# Altium schematic sheet DAC.SchDoc
size A4
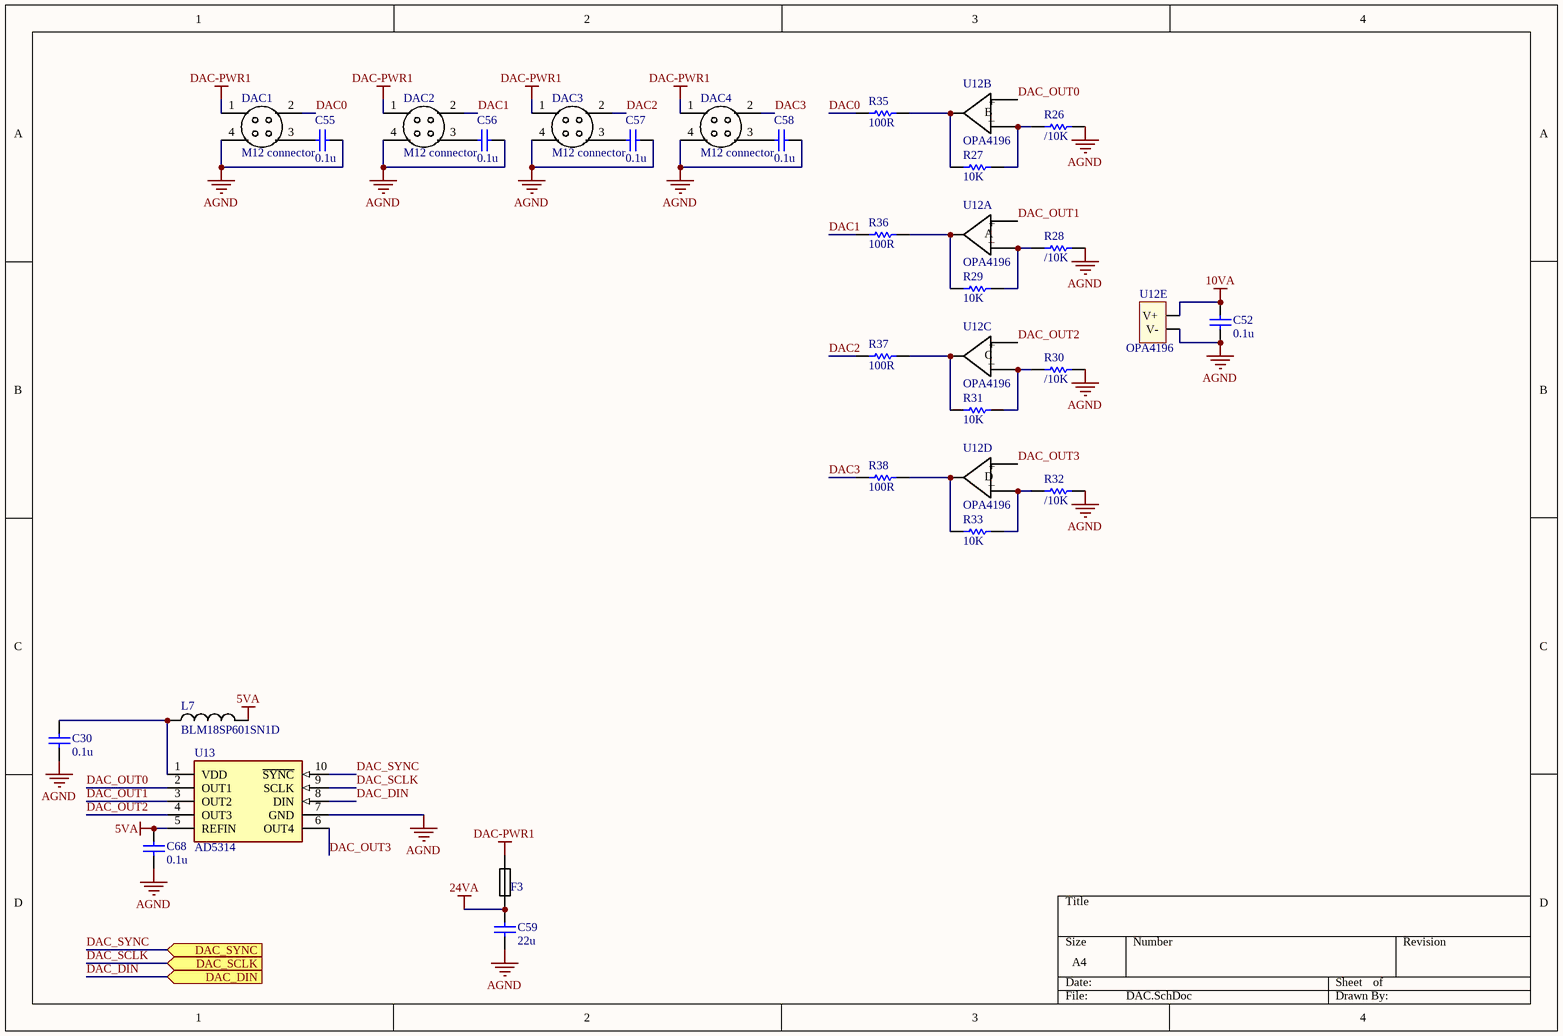
[diagram p0: DAC.SchDoc]

## Parts
C30  value 0.1u  [CAPC1608X90N]  (hidden comment: Cap)
C52  value 0.1u  [CAPC1608X90N]  (hidden comment: Cap)
C55  value 0.1u  [CAPC1608X90N]  (hidden comment: Cap)
C56  value 0.1u  [CAPC1608X90N]  (hidden comment: Cap)
C57  value 0.1u  [CAPC1608X90N]  (hidden comment: Cap)
C58  value 0.1u  [CAPC1608X90N]  (hidden comment: Cap)
C59  value 22u  [CAPC2012X135N]  (hidden comment: Cap)
C68  value 0.1u  [CAPC1608X90N]  (hidden comment: Cap)
DAC1  M12 connector  [GX12_PCB_Mount]
DAC2  M12 connector  [GX12_PCB_Mount]
DAC3  M12 connector  [GX12_PCB_Mount]
DAC4  M12 connector  [GX12_PCB_Mount]
F3  MFU0805FF00500P100  [RESC2012X70N]  (value not drawn)
L7  BLM18SP601SN1D  [INDC1608N]
R26  value /10K  [RESC1608X55N]  (hidden comment: Res1)
R27  value 10K  [RESC1608X55N]  (hidden comment: Res1)
R28  value /10K  [RESC1608X55N]  (hidden comment: Res1)
R29  value 10K  [RESC1608X55N]  (hidden comment: Res1)
R30  value /10K  [RESC1608X55N]  (hidden comment: Res1)
R31  value 10K  [RESC1608X55N]  (hidden comment: Res1)
R32  value /10K  [RESC1608X55N]  (hidden comment: Res1)
R33  value 10K  [RESC1608X55N]  (hidden comment: Res1)
R35  value 100R  [RESC1608X55N]  (hidden comment: Res1)
R36  value 100R  [RESC1608X55N]  (hidden comment: Res1)
R37  value 100R  [RESC1608X55N]  (hidden comment: Res1)
R38  value 100R  [RESC1608X55N]  (hidden comment: Res1)
U12  OPA4196  [SOIC127P600X175-14AN]  (parts A,B,C,D,E of 5)
U13  AD5314  [MSOP10_no_EP]

## Ports
DAC_DIN (in), DAC_SCLK (in), DAC_SYNC (in)

## Nets
5VA: C68.1 L7.1 U13.5(REFIN)
10VA: C52.1 U12.4(V+)
24VA: C59.2 F3.1
AGND: C30.2 C52.2 C55.1 C56.1 C57.1 C58.1 C59.1 C68.2 DAC1.4 DAC2.4 DAC3.4 DAC4.4 R26.2 R28.2 R30.2 R32.2 U12.11(V-) U13.7(GND)
DAC-PWR1: DAC1.1 DAC2.1 DAC3.1 DAC4.1 F3.2
DAC0: DAC1.2 R35.1
DAC1: DAC2.2 R36.1
DAC2: DAC3.2 R37.1
DAC3: DAC4.2 R38.1
DAC_DIN: U13.8(DIN) ; port DAC_DIN
DAC_OUT0: U12.5(INB+) U13.2(OUT1)
DAC_OUT1: U12.3(INA+) U13.3(OUT2)
DAC_OUT2: U12.10(INC+) U13.4(OUT3)
DAC_OUT3: U12.12(IND+) U13.6(OUT4)
DAC_SCLK: U13.9(SCLK) ; port DAC_SCLK
DAC_SYNC: U13.10(~{SYNC}) ; port DAC_SYNC
NetC30_1: C30.1 L7.2 U13.1(VDD)
NetC55_2: C55.2 DAC1.3
NetC56_2: C56.2 DAC2.3
NetC57_2: C57.2 DAC3.3
NetC58_2: C58.2 DAC4.3
NetR26_1: R26.1 R27.2 U12.6(INB-)
NetR27_1: R27.1 R35.2 U12.7(OUT_B)
NetR28_1: R28.1 R29.2 U12.2(INA-)
NetR29_1: R29.1 R36.2 U12.1(OUT_A)
NetR30_1: R30.1 R31.2 U12.9(INC-)
NetR31_1: R31.1 R37.2 U12.8(OUT_C)
NetR32_1: R32.1 R33.2 U12.13(IND-)
NetR33_1: R33.1 R38.2 U12.14(OUT_D)

## Notes on the sheet
- (in symbol OPA4196, part A) +; A; _
- (in symbol OPA4196, part B) +; B; _
- (in symbol OPA4196, part C) +; C; _
- (in symbol OPA4196, part D) +; D; _

## Library data of the parts
C30 C52 C55-C59 C68 = Cap: Capacitor; Published: 8-Jun-2000; LatestRevisionDate: 17-Jul-2002; LatestRevisionNote: Re-released for DXP Platform.; PackageReference: RAD-0.3; Publisher: Altium Limited; PackageDescription: Radial Cap, Thru-Hole; 2 Leads; 0.3 in Pin Spacing
DAC1-DAC4 = M12_connector: M12 connect with 4 pin, current 4A per terminal; ComponentLink1Description: Purchase; ComponentLink1URL: https://item.taobao.com/item.htm?spm=a230r.1.14.42.72f34373kzOCRP&id=571188244354&ns=1&abbucket=18#detail
F3 = FUSE_32V_500MA_0805: fuse 32V 0.5A
L7 = INC_BLM18SP601SN1D: Ferritebead 1.5A, max 600ohm resistance
R26-R33 R35-R38 = Res1: Resistor; Published: 8-Jun-2000; LatestRevisionDate: 17-Jul-2002; LatestRevisionNote: Re-released for DXP Platform.; PackageReference: AXIAL-0.3; Publisher: Altium Limited; PackageDescription: Axial Device, Thru-Hole; 2 Leads; 0.3 in Pin Spacing
U12 = OPA4196: operational amplifier 36V input
U13 = AD5314: 10-bit DAC 4 channel